# EAGLE schematic untitled (EAGLE 8.0.1)
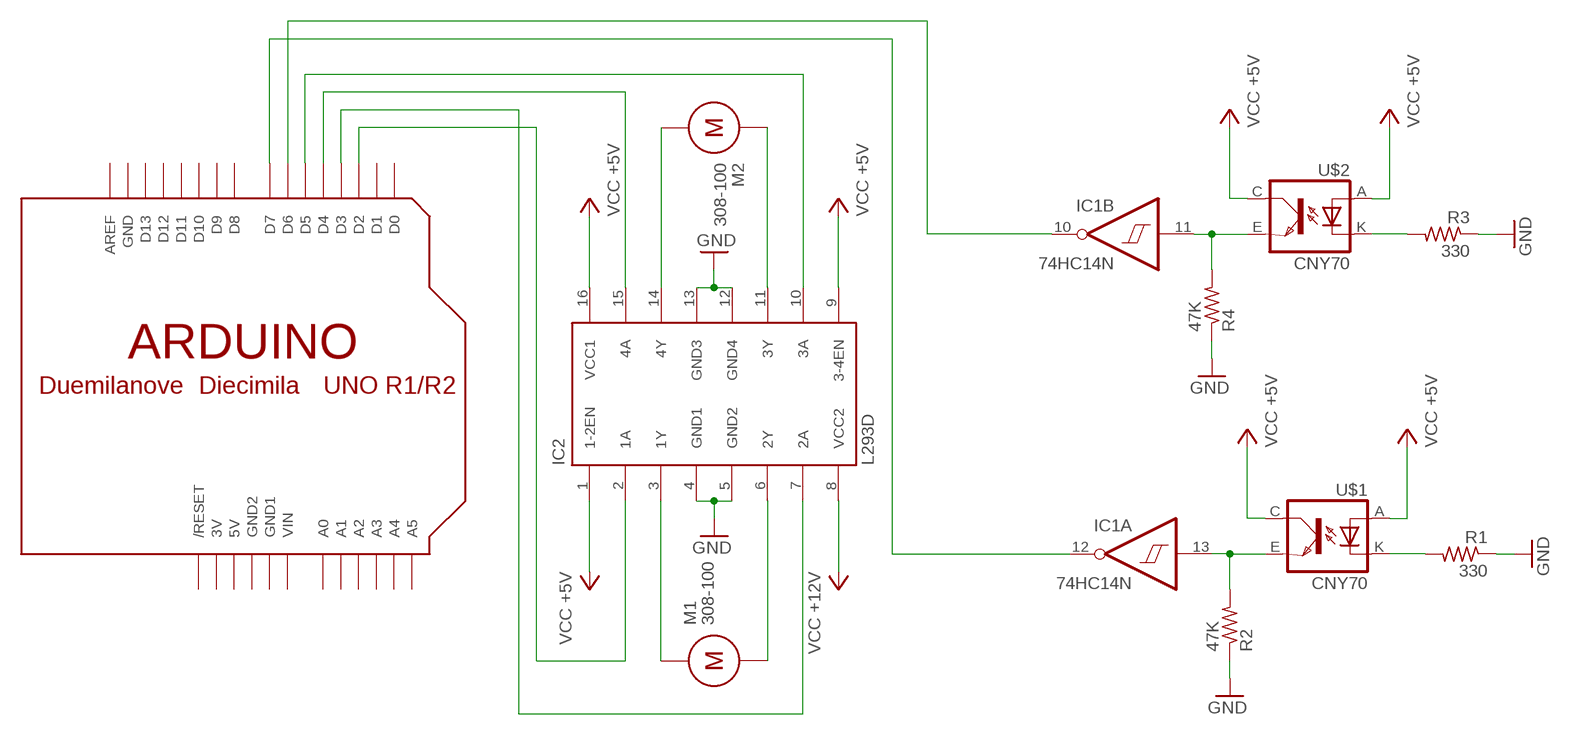
[diagram p0: schematic, sheet 1]

## Parts
IC1  74HC14N  [DIL14]
IC2  L293D  [DIL16]
M1  308-100  [308-100]
M2  308-100  [308-100]
R1  330  R-US_0204/5  [0204/5]
R2  47K  R-US_0204/5  [0204/5]
R3  330  R-US_0204/5  [0204/5]
R4  47K  R-US_0204/5  [0204/5]
U$1  CNY70  [4]
U$2  CNY70  [4]
U$3  ARDUINOUNO  [ARDUINO]

## Nets
GND: IC2.4(GND1) IC2.5(GND2) IC2.12(GND4) IC2.13(GND3) R1.1 R2.1 R3.1 R4.1
N$1: R1.2 U$1.K(C)
N$2: R3.2 U$2.K(C)
N$3: IC1.13(A:I) R2.2 U$1.E(EMI)
N$4: IC1.11(B:I) R4.2 U$2.E(EMI)
N$5: IC2.2(1A) U$3.D2
N$6: IC2.7(2A) U$3.D3
N$7: IC2.14(4Y) M2.NEG
N$8: IC2.11(3Y) M2.POS
N$9: IC2.6(2Y) M1.NEG
N$10: IC2.3(1Y) M1.POS
N$11: IC2.15(4A) U$3.D4
N$12: IC2.10(3A) U$3.D5
N$13: IC1.12(A:O) U$3.D7
N$14: IC1.10(B:O) U$3.D6
VCC: IC2.1(1-2EN) IC2.8(VCC2) IC2.9(3-4EN) IC2.16(VCC1) U$1.A U$1.C(COL) U$2.A U$2.C(COL) ; supply symbol labelled VCC +5V, VCC +12V
Unconnected: IC1.1(D:I) IC1.2(D:O) IC1.3(E:I) IC1.4(E:O) IC1.5(F:I) IC1.6(F:O) IC1.8(C:O) IC1.9(C:I) U$3.A0 U$3.A1 U$3.A2 U$3.A3 U$3.A4 U$3.A5 U$3.AREF U$3.D0 U$3.D1 U$3.D8 U$3.D9 U$3.D10 U$3.D11 U$3.D12 U$3.D13 U$3.RESET(/RESET)

## Power pins joined to a net without a drawn wire
3V: U$3.3V
5V: U$3.5V
GND: IC1.7(P:GND) U$3.GND
GND1: U$3.GND1
GND2: U$3.GND2
VCC: IC1.14(P:VCC)
VIN: U$3.VIN

## Library data of the parts
IC1 = 74xx-eu:74*14: Hex schmitt trigger INVERTER
IC2 = st-microelectronics:L293D: PUSH-PULL 4 CHANNEL DRIVER; MPN: L293D; OC_FARNELL: 9589619; OC_NEWARK: 56P8249
M1 M2 = motor:308-100: Pico Vibe 8mm Vibration Motor - 3mm Type; PRECISION_MICRODRIVES: 308-100
R1-R4 = adafruit:R-US_: RESISTOR, American symbol
U$1 U$2 = cny70:CNY70
U$3 = adafruit:ARDUINO: Arduino Diecimila/Duemilanove Make a shield with ease, this package has all the named pins as well as the two mounting drill holes and an outline of the USB and DC power connector. The outline is on the DIMENSION layer, so if your board house uses it they will cut the outline to match. http://www.ladyada.net/library/pcb/eaglelibrary.html